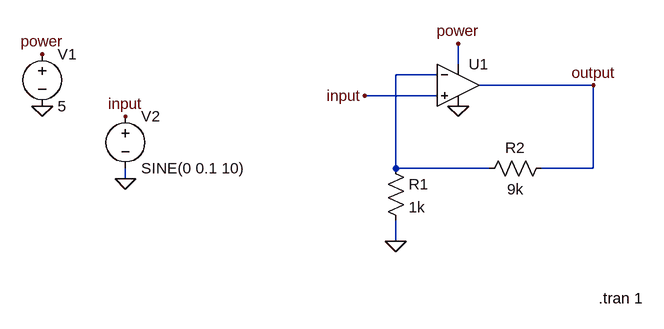
[diagram p0: schematic Draft1.asc]
Draft1.asc, the LTspice schematic file:
Version 4.1
SHEET 1 880 680
WIRE 272 128 272 96
WIRE 240 144 176 144
WIRE 480 160 304 160
WIRE 240 176 128 176
WIRE 176 288 176 144
WIRE 320 288 176 288
WIRE 480 288 480 160
WIRE 480 288 400 288
WIRE -240 304 -240 288
WIRE 176 400 176 368
FLAG -368 192 0
FLAG 272 192 0
FLAG 272 96 power
FLAG -368 112 power
FLAG 176 400 0
FLAG -240 304 0
FLAG -240 208 input
FLAG 128 176 input
FLAG 480 160 output
SYMBOL OpAmps\\UniversalOpAmp1 272 160 R0
SYMATTR InstName U1
SYMBOL res 160 272 R0
SYMATTR InstName R1
SYMATTR Value 1k
SYMBOL res 416 272 R90
WINDOW 0 0 56 VBottom 2
WINDOW 3 32 56 VTop 2
SYMATTR InstName R2
SYMATTR Value 9k
SYMBOL voltage -368 96 R0
WINDOW 123 0 0 Left 0
WINDOW 39 0 0 Left 0
SYMATTR InstName V1
SYMATTR Value 5
SYMBOL voltage -240 192 R0
WINDOW 123 0 0 Left 0
WINDOW 39 0 0 Left 0
SYMATTR InstName V2
SYMATTR Value SINE(0 0.1 10)
TEXT 488 488 Left 2 !.tran 1

The netlist it stands for:
* Draft1.asc
X§U1 input N001 power 0 output level1 Avol=1Meg GBW=10Meg Vos=0 En=0 Enk=0 In=0 Ink=0 Rin=500Meg  ; pins In+ In- V+ V- OUT
R1 N001 0 1k
R2 output N001 9k
V1 power 0 5
V2 input 0 SINE(0 0.1 10)
.tran 1
.lib UniversalOpAmp1.lib
.backanno
.end